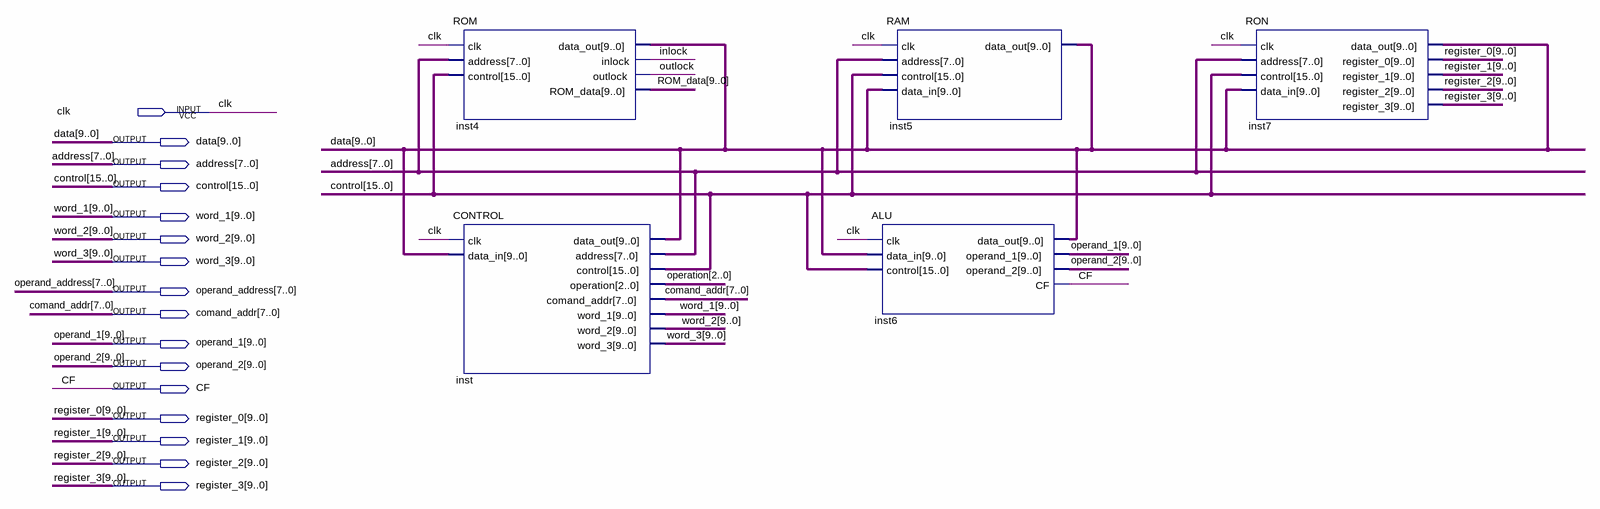
[diagram p0: schematic sheet]
// Quartus schematic MAIN.bdf as structural Verilog: 5 symbols, 16 pins
module MAIN (
  input  clk,
  output [9:0] data,
  output [7:0] address,
  output [15:0] control,
  output [9:0] word_1,
  output [9:0] word_2,
  output [9:0] word_3,
  output [7:0] operand_address,
  output [7:0] comand_addr,
  output [9:0] operand_1,
  output [9:0] operand_2,
  output CF,
  output [9:0] register_0,
  output [9:0] register_1,
  output [9:0] register_2,
  output [9:0] register_3
);

  wire inlock, outlock;
  wire [2:0] operation;
  wire [9:0] ROM_data;

  ROM inst4 (
    .clk(clk), .address(address), .control(control), .data_out(data), .inlock(inlock), .outlock(outlock),
    .ROM_data(ROM_data));
  CONTROL inst (
    .clk(clk), .data_in(data), .data_out(data), .address(address), .control(control), .operation(operation),
    .comand_addr(comand_addr), .word_1(word_1), .word_2(word_2), .word_3(word_3));
  ALU inst6 (
    .clk(clk), .data_in(data), .control(control), .data_out(data), .operand_1(operand_1),
    .operand_2(operand_2), .CF(CF));
  RAM inst5 (.clk(clk), .address(address), .control(control), .data_in(data), .data_out(data));
  RON inst7 (
    .clk(clk), .address(address), .control(control), .data_in(data), .data_out(data),
    .register_0(register_0), .register_1(register_1), .register_2(register_2), .register_3(register_3));
endmodule
